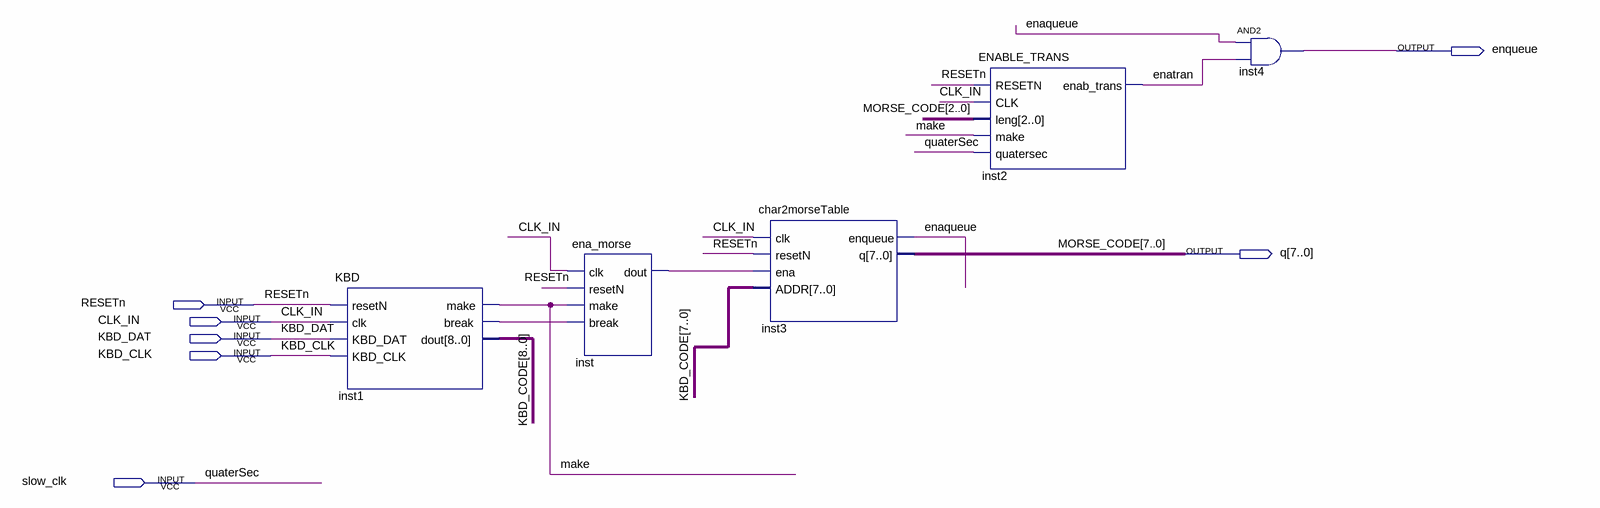
[diagram p0: schematic sheet]
// Quartus schematic U2M.bdf as structural Verilog: 5 symbols, 7 pins
module U2M (
  input  RESETn,
  input  CLK_IN,
  input  KBD_DAT,
  input  KBD_CLK,
  input  slow_clk,
  output enqueue,
  output [7:0] q
);

  wire enaqueue, enatran, inst1_break, inst_dout, make;
  wire [8:0] KBD_CODE;

  KBD inst1 (
    .resetN(RESETn), .clk(CLK_IN), .KBD_DAT(KBD_DAT), .KBD_CLK(KBD_CLK), .make(make), .\break (inst1_break),
    .dout(KBD_CODE));
  ena_morse inst (.clk(CLK_IN), .resetN(RESETn), .make(make), .\break (inst1_break), .dout(inst_dout));
  char2morseTable inst3 (
    .clk(CLK_IN), .resetN(RESETn), .ena(inst_dout), .ADDR(KBD_CODE[7:0]), .enqueue(enaqueue), .q(q));
  ENABLE_TRANS inst2 (
    .RESETN(RESETn), .CLK(CLK_IN), .leng(q[2:0]), .make(make), .quatersec(slow_clk), .enab_trans(enatran));
  and inst4 (enqueue, enaqueue, enatran);

  // Other names for the same wires on the sheet: MORSE_CODE[7:0] = q; quaterSec = slow_clk
endmodule
